# EAGLE schematic koshian_Ring (EAGLE 7.6.0)
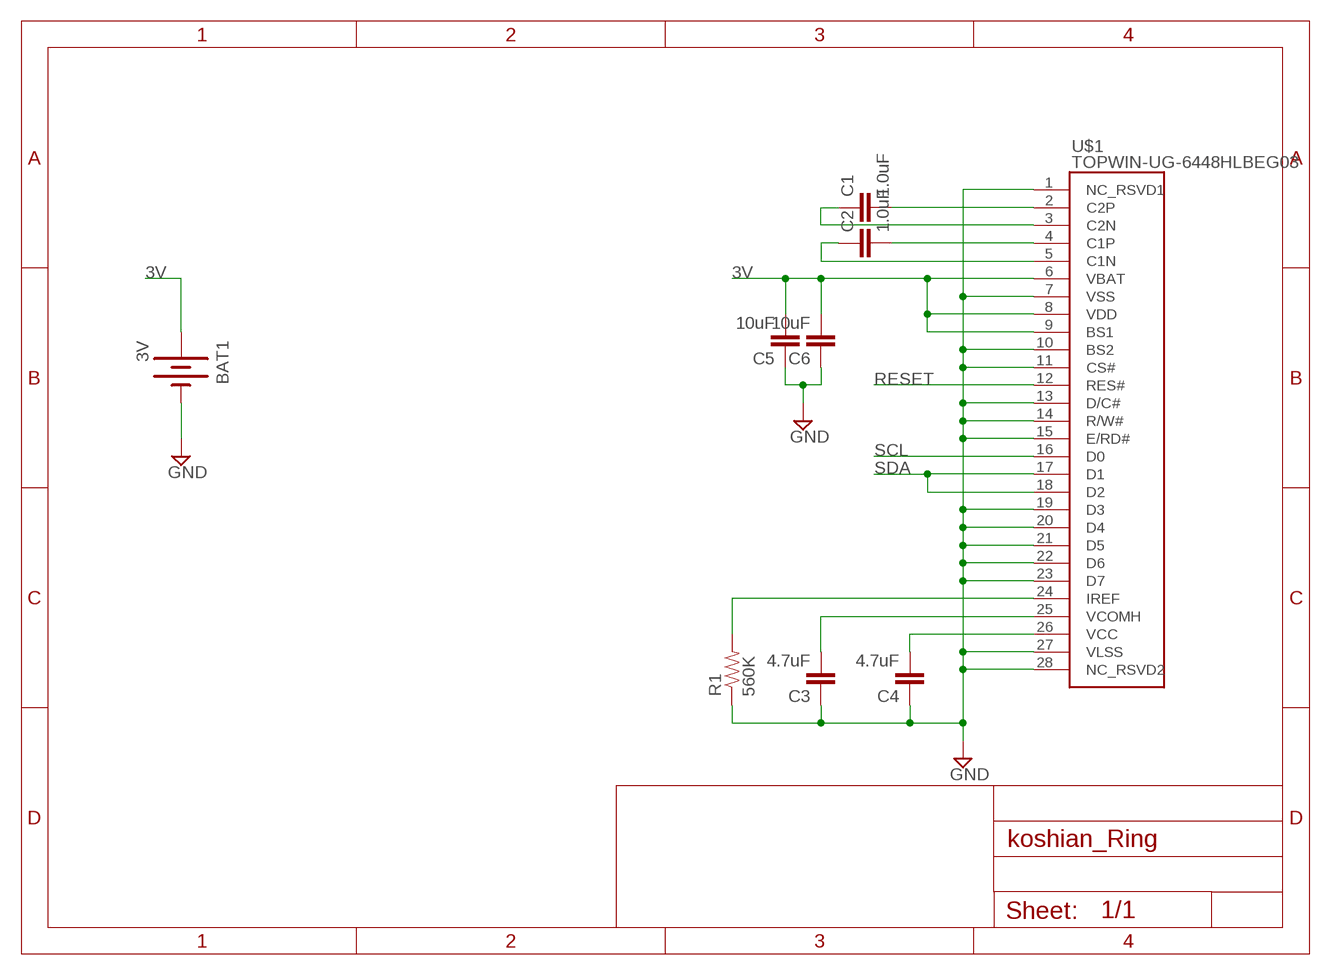
[diagram p0: schematic, sheet 1]

## Parts
BAT1  3V  BATTERY20SMD  [BATTCON_20MM]
C1  1.0uF  1.0UF50V10%(1206)  [1206-CAP]
C2  1.0uF  1.0UF50V10%(1206)  [1206-CAP]
C3  4.7uF  4.7UF-16V-20%,+80%-(1206)  [1206-CAP]
C4  4.7uF  4.7UF-16V-20%,+80%-(1206)  [1206-CAP]
C5  10uF  4.7UF-16V-20%,+80%-(1206)  [1206-CAP]
C6  10uF  4.7UF-16V-20%,+80%-(1206)  [1206-CAP]
R1  560K  RESISTOR1206  [1206]
U$1  TOPWIN-UG-6448HLBEG03  [TOPWIN-UG-6448HLBEG03]

## Nets
3V: BAT1.1(+) C5.2 C6.2 U$1.6(VBAT) U$1.8(VDD) U$1.9(BS1)
GND: BAT1.2(-) C3.1 C4.1 C5.1 C6.1 R1.1 U$1.1(NC_RSVD1) U$1.7(VSS) U$1.10(BS2) U$1.11(CS#) U$1.13(D/C#) U$1.14(R/W#) U$1.15(E/RD#) U$1.19(D3) U$1.20(D4) U$1.21(D5) U$1.22(D6) U$1.23(D7) U$1.27(VLSS) U$1.28(NC_RSVD2)
N$2: C1.2 U$1.2(C2P)
N$3: C1.1 U$1.3(C2N)
N$4: C2.2 U$1.4(C1P)
N$5: C2.1 U$1.5(C1N)
N$7: R1.2 U$1.24(IREF)
N$8: C4.2 U$1.26(VCC)
N$9: C3.2 U$1.25(VCOMH)
RESET: U$1.12(RES#)
SCL: U$1.16(D0)
SDA: U$1.17(D1) U$1.18(D2)

## Library data of the parts
BAT1 = SparkFun-Electromechanical:BATTERY: Battery Holders Various common sizes : AA, AAA, 18650 (PRT-12895), 20mm coin cell and 12mm coin cell. 20MM_4LEGS, BATT-10373
C1 C2 = SparkFun-Capacitors:1.0UF50V10%(1206): CAP-09822; PROD_ID: CAP-09822
C3 C4 = SparkFun-Capacitors:4.7UF-16V-20%,+80%-(1206): CAP-10300; PROD_ID: CAP-10300
C5 C6 = SparkFun-Capacitors:4.7UF-16V-20%,+80%-(1206): CAP-10300; PROD_ID: CAP-10300; VALUE: 4.7uF
R1 = SparkFun-Resistors:RESISTOR: Resistor Basic schematic elements and footprints for 0603, 1206, and PTH resistors.
U$1 = topwin-UG-6448HLBEG03:TOPWIN-UG-6448HLBEG03